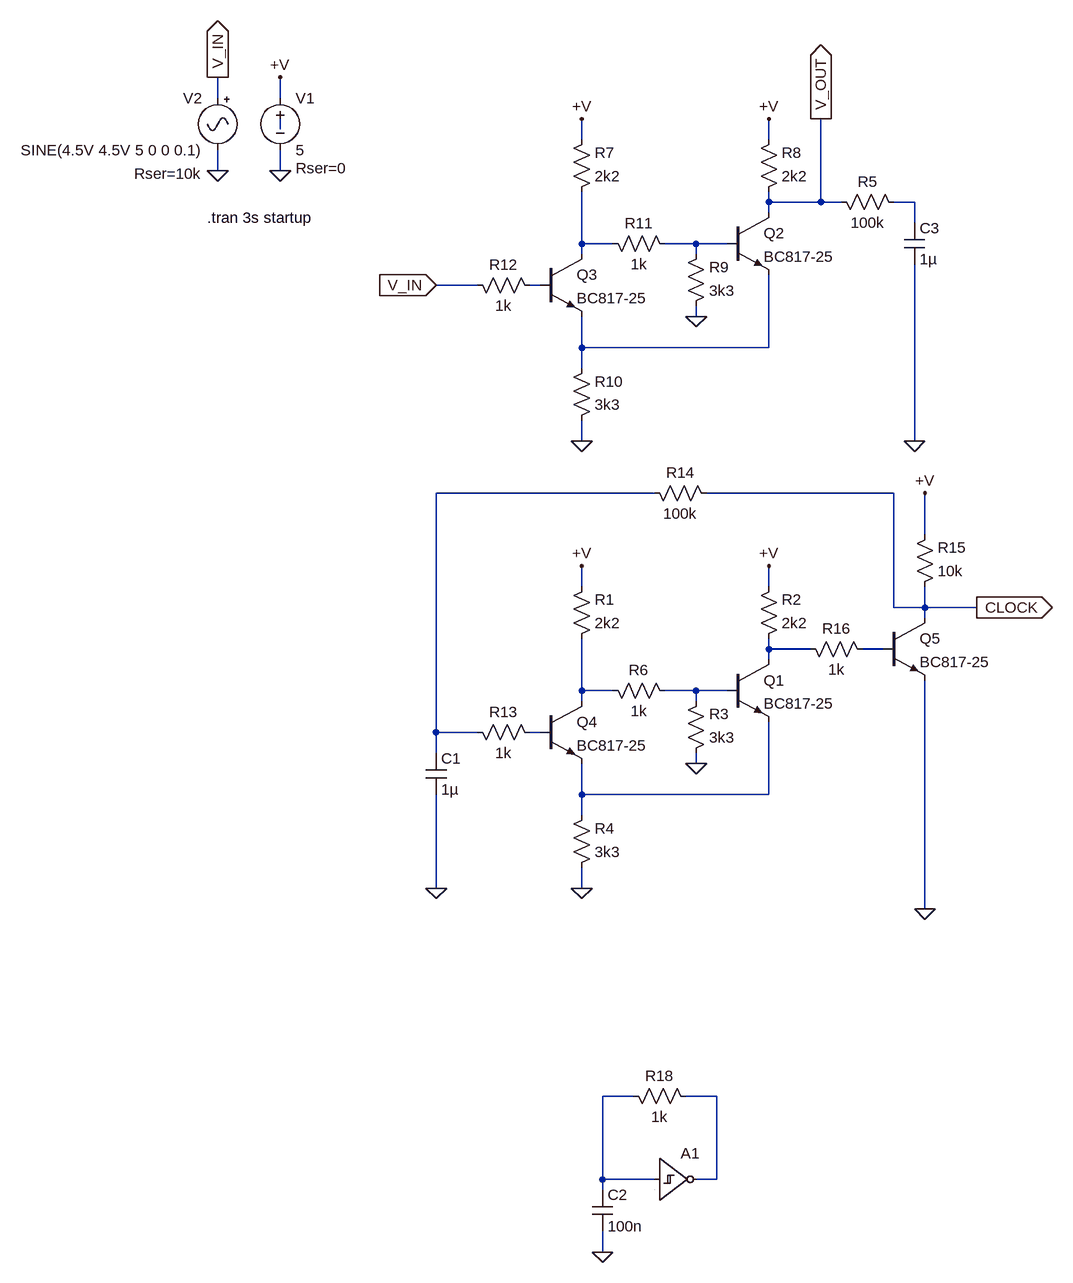
[diagram p0: schematic oscilator.asc]
oscilator.asc, the LTspice schematic file:
Version 4
SHEET 1 1532 2052
WIRE -384 192 -384 160
WIRE -288 192 -288 160
WIRE -288 240 -288 224
WIRE 176 256 176 224
WIRE 464 256 464 224
WIRE -384 304 -384 272
WIRE -288 304 -288 272
WIRE 464 352 464 336
WIRE 544 352 544 224
WIRE 544 352 464 352
WIRE 576 352 544 352
WIRE 688 352 656 352
WIRE 464 368 464 352
WIRE 688 384 688 352
WIRE 176 416 176 336
WIRE 224 416 176 416
WIRE 352 416 304 416
WIRE 400 416 352 416
WIRE 176 432 176 416
WIRE 352 432 352 416
WIRE 16 480 -48 480
WIRE 112 480 96 480
WIRE 352 528 352 512
WIRE 176 576 176 528
WIRE 464 576 464 464
WIRE 464 576 176 576
WIRE 176 608 176 576
WIRE 176 720 176 688
WIRE 688 720 688 448
WIRE 288 800 -48 800
WIRE 656 800 368 800
WIRE 704 864 704 800
WIRE 176 944 176 912
WIRE 464 944 464 912
WIRE 656 976 656 800
WIRE 704 976 704 944
WIRE 704 976 656 976
WIRE 784 976 704 976
WIRE 704 992 704 976
WIRE 464 1040 464 1024
WIRE 528 1040 464 1040
WIRE 640 1040 608 1040
WIRE 464 1056 464 1040
WIRE 176 1104 176 1024
WIRE 224 1104 176 1104
WIRE 352 1104 304 1104
WIRE 400 1104 352 1104
WIRE 176 1120 176 1104
WIRE 352 1120 352 1104
WIRE -48 1168 -48 800
WIRE 16 1168 -48 1168
WIRE 112 1168 96 1168
WIRE -48 1200 -48 1168
WIRE 352 1216 352 1200
WIRE 176 1264 176 1216
WIRE 464 1264 464 1152
WIRE 464 1264 176 1264
WIRE 176 1296 176 1264
WIRE -48 1408 -48 1264
WIRE 176 1408 176 1376
WIRE 704 1440 704 1088
WIRE 256 1728 208 1728
WIRE 384 1728 336 1728
WIRE 208 1856 208 1728
WIRE 288 1856 208 1856
WIRE 384 1856 384 1728
WIRE 384 1856 352 1856
WIRE 208 1872 208 1856
WIRE 208 1968 208 1936
FLAG -288 304 0
FLAG -384 304 0
FLAG -288 160 +V
FLAG -384 160 V_IN
IOPIN -384 160 Out
FLAG 464 224 +V
FLAG 352 528 0
FLAG 176 720 0
FLAG 176 224 +V
FLAG 544 224 V_OUT
IOPIN 544 224 Out
FLAG 688 720 0
FLAG 464 912 +V
FLAG 352 1216 0
FLAG 176 1408 0
FLAG 176 912 +V
FLAG 784 976 CLOCK
IOPIN 784 976 Out
FLAG -48 1408 0
FLAG -48 480 V_IN
IOPIN -48 480 In
FLAG 704 800 +V
FLAG 704 1440 0
FLAG 208 1968 0
SYMBOL voltage -288 176 R0
WINDOW 123 0 0 Left 2
WINDOW 39 24 124 Left 2
SYMATTR SpiceLine Rser=0
SYMATTR InstName V1
SYMATTR Value 5
SYMBOL Misc\\signal -384 176 M0
WINDOW 123 0 0 Left 2
WINDOW 39 24 132 Left 2
SYMATTR SpiceLine Rser=10k
SYMATTR InstName V2
SYMATTR Value SINE(4.5V 4.5V 5 0 0 0.1)
SYMBOL npn 400 368 R0
SYMATTR InstName Q2
SYMATTR Value BC817-25
SYMBOL npn 112 432 R0
SYMATTR InstName Q3
SYMATTR Value BC817-25
SYMBOL res 160 352 M180
WINDOW 0 36 76 Left 2
WINDOW 3 36 40 Left 2
SYMATTR InstName R7
SYMATTR Value 2k2
SYMBOL res 448 352 M180
WINDOW 0 36 76 Left 2
WINDOW 3 36 40 Left 2
SYMATTR InstName R8
SYMATTR Value 2k2
SYMBOL res 336 528 M180
WINDOW 0 36 76 Left 2
WINDOW 3 36 40 Left 2
SYMATTR InstName R9
SYMATTR Value 3k3
SYMBOL res 160 704 M180
WINDOW 0 36 76 Left 2
WINDOW 3 36 40 Left 2
SYMATTR InstName R10
SYMATTR Value 3k3
SYMBOL res 208 400 M90
WINDOW 0 0 56 VBottom 2
WINDOW 3 32 56 VTop 2
SYMATTR InstName R11
SYMATTR Value 1k
SYMBOL res 0 464 M90
WINDOW 0 0 56 VBottom 2
WINDOW 3 32 56 VTop 2
SYMATTR InstName R12
SYMATTR Value 1k
SYMBOL res 560 336 M90
WINDOW 0 0 56 VBottom 2
WINDOW 3 32 56 VTop 2
SYMATTR InstName R5
SYMATTR Value 100k
SYMBOL cap 672 384 R0
SYMATTR InstName C3
SYMATTR Value 1µ
SYMBOL npn 400 1056 R0
SYMATTR InstName Q1
SYMATTR Value BC817-25
SYMBOL npn 112 1120 R0
SYMATTR InstName Q4
SYMATTR Value BC817-25
SYMBOL res 160 1040 M180
WINDOW 0 36 76 Left 2
WINDOW 3 36 40 Left 2
SYMATTR InstName R1
SYMATTR Value 2k2
SYMBOL res 448 1040 M180
WINDOW 0 36 76 Left 2
WINDOW 3 36 40 Left 2
SYMATTR InstName R2
SYMATTR Value 2k2
SYMBOL res 336 1216 M180
WINDOW 0 36 76 Left 2
WINDOW 3 36 40 Left 2
SYMATTR InstName R3
SYMATTR Value 3k3
SYMBOL res 160 1392 M180
WINDOW 0 36 76 Left 2
WINDOW 3 36 40 Left 2
SYMATTR InstName R4
SYMATTR Value 3k3
SYMBOL res 208 1088 M90
WINDOW 0 0 56 VBottom 2
WINDOW 3 32 56 VTop 2
SYMATTR InstName R6
SYMATTR Value 1k
SYMBOL res 0 1152 M90
WINDOW 0 0 56 VBottom 2
WINDOW 3 32 56 VTop 2
SYMATTR InstName R13
SYMATTR Value 1k
SYMBOL res 272 784 M90
WINDOW 0 0 56 VBottom 2
WINDOW 3 32 56 VTop 2
SYMATTR InstName R14
SYMATTR Value 100k
SYMBOL cap -64 1200 R0
SYMATTR InstName C1
SYMATTR Value 1µ
SYMBOL npn 640 992 R0
SYMATTR InstName Q5
SYMATTR Value BC817-25
SYMBOL res 688 960 M180
WINDOW 0 36 76 Left 2
WINDOW 3 36 40 Left 2
SYMATTR InstName R15
SYMATTR Value 10k
SYMBOL res 512 1024 M90
WINDOW 0 0 56 VBottom 2
WINDOW 3 32 56 VTop 2
SYMATTR InstName R16
SYMATTR Value 1k
SYMBOL Digital\\schmtinv 288 1792 R0
SYMATTR InstName A1
SYMBOL cap 192 1872 R0
SYMATTR InstName C2
SYMATTR Value 100n
SYMBOL res 240 1712 M90
WINDOW 0 0 56 VBottom 2
WINDOW 3 32 56 VTop 2
SYMATTR InstName R18
SYMATTR Value 1k
TEXT -400 376 Left 2 !.tran 3s startup

The netlist it stands for:
* oscilator.asc
V1 +V 0 5 Rser=0
V2 V_IN 0 SINE(4.5V 4.5V 5 0 0 0.1) Rser=10k
Q2 V_OUT N004 N006 0 BC817-25
Q3 N003 N005 N006 0 BC817-25
R7 N003 +V 2k2
R8 V_OUT +V 2k2
R9 0 N004 3k3
R10 0 N006 3k3
R11 N003 N004 1k
R12 V_IN N005 1k
R5 V_OUT N002 100k
C3 N002 0 1µ
Q1 N008 N011 N013 0 BC817-25
Q4 N010 N012 N013 0 BC817-25
R1 N010 +V 2k2
R2 N008 +V 2k2
R3 0 N011 3k3
R4 0 N013 3k3
R6 N010 N011 1k
R13 N007 N012 1k
R14 N007 CLOCK 100k
C1 N007 0 1µ
Q5 CLOCK N009 0 0 BC817-25
R15 CLOCK +V 10k
R16 N008 N009 1k
A1 N014 0 0 0 0 N015 0 0 SCHMITT
C2 N014 0 100n
R18 N014 N015 1k
.model NPN NPN
.model PNP PNP
.lib standard.bjt
.tran 3s startup
.backanno
.end